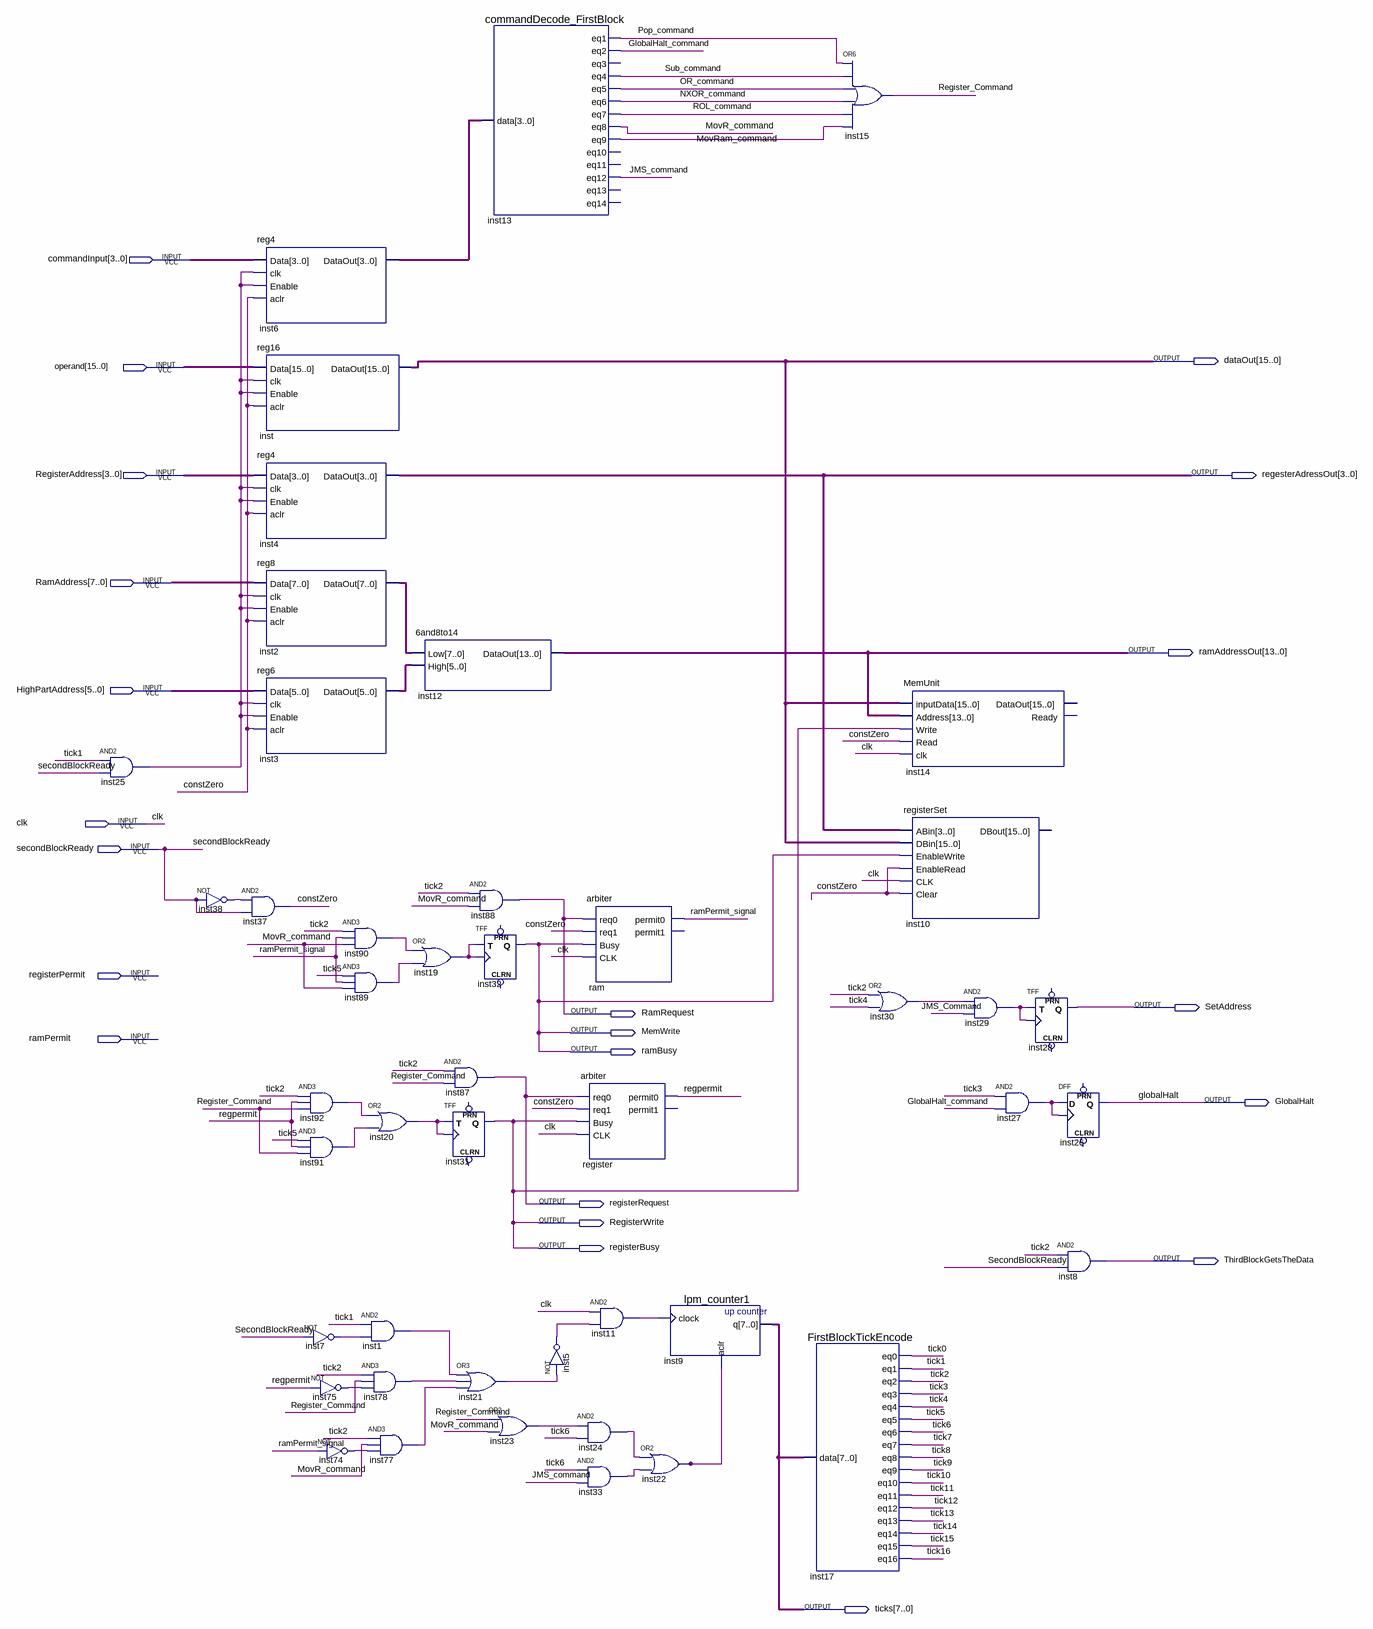
[diagram p0: schematic sheet]
// Quartus schematic WriteBlock.bdf as structural Verilog: 46 symbols, 22 pins
module WriteBlock (
  input  [3:0] commandInput,
  input  [15:0] operand,
  input  [3:0] RegisterAddress,
  input  [7:0] RamAddress,
  input  [5:0] HighPartAddress,
  input  clk,
  input  secondBlockReady,
  input  registerPermit,
  input  ramPermit,
  output [15:0] dataOut,
  output [3:0] regesterAdressOut,
  output [13:0] ramAddressOut,
  output SetAddress,
  output RamRequest,
  output MemWrite,
  output ramBusy,
  output GlobalHalt,
  output registerRequest,
  output RegisterWrite,
  output registerBusy,
  output ThirdBlockGetsTheData,
  output [7:0] ticks
);

  wire constZero, GlobalHalt_command, inst1_out, inst5_out, inst7_out, inst11_out, inst19_out, inst20_out,
       inst21_out, inst22_out, inst23_out, inst24_out, inst25_out, inst27_out, inst29_out, inst30_out,
       inst33_out, inst38_out, inst74_out, inst75_out, inst77_out, inst78_out, inst89_out, inst90_out,
       inst91_out, inst92_out, JMS_command, MovR_command, MovRam_command, NXOR_command, OR_command,
       Pop_command, ramPermit_signal, Register_Command, regpermit, ROL_command, Sub_command, tick0, tick1,
       tick2, tick3, tick4, tick5, tick6, tick7, tick8, tick9, tick10, tick11, tick12, tick13, tick14,
       tick15, tick16;
  wire [3:0] inst6_dataout;
  wire [5:0] inst3_dataout;
  wire [7:0] inst2_dataout;

  and inst25 (inst25_out, tick1, secondBlockReady);
  not inst38 (inst38_out, secondBlockReady);
  reg4 inst6 (.Data(commandInput), .clk(inst25_out), .Enable(inst25_out), .aclr(constZero), .DataOut(inst6_dataout));
  reg16 inst (.Data(operand), .clk(inst25_out), .Enable(inst25_out), .aclr(constZero), .DataOut(dataOut));
  reg4 inst4 (
    .Data(RegisterAddress), .clk(inst25_out), .Enable(inst25_out), .aclr(constZero),
    .DataOut(regesterAdressOut));
  reg8 inst2 (.Data(RamAddress), .clk(inst25_out), .Enable(inst25_out), .aclr(constZero), .DataOut(inst2_dataout));
  reg6 inst3 (.Data(HighPartAddress), .clk(inst25_out), .Enable(inst25_out), .aclr(constZero), .DataOut(inst3_dataout));
  and inst37 (constZero, inst38_out, secondBlockReady);
  and inst92 (inst92_out, tick2, regpermit, Register_Command);
  and inst91 (inst91_out, tick5, regpermit, Register_Command);
  not inst7 (inst7_out, secondBlockReady);
  and inst90 (inst90_out, tick2, ramPermit_signal, MovR_command);
  and inst89 (inst89_out, tick5, ramPermit_signal, MovR_command);
  and inst1 (inst1_out, tick1, inst7_out);
  not inst75 (inst75_out, regpermit);
  not inst74 (inst74_out, ramPermit_signal);
  or inst20 (inst20_out, inst92_out, inst91_out);
  and inst78 (inst78_out, tick2, Register_Command, inst75_out);
  and inst77 (inst77_out, tick2, MovR_command, inst74_out);
  \6and8to14  inst12 (.Low(inst2_dataout), .High(inst3_dataout), .DataOut(ramAddressOut));
  or inst19 (inst19_out, inst90_out, inst89_out);
  and inst87 (registerRequest, tick2, Register_Command);
  TFF inst31 (.T(inst20_out), .CLK(inst20_out), .Q(registerBusy));  // open: PRN, CLRN
  or inst21 (inst21_out, inst1_out, inst78_out, inst77_out);
  commandDecode_FirstBlock inst13 (
    .data(inst6_dataout), .eq1(Pop_command), .eq2(GlobalHalt_command), .eq4(Sub_command), .eq5(OR_command),
    .eq6(NXOR_command), .eq7(ROL_command), .eq8(MovR_command), .eq9(MovRam_command), .eq12(JMS_command));  // open: eq3, eq10, eq11, eq13, eq14
  and inst88 (RamRequest, tick2, MovR_command);
  TFF inst32 (.T(inst19_out), .CLK(inst19_out), .Q(MemWrite));  // open: PRN, CLRN
  or inst23 (inst23_out, Register_Command, MovR_command);
  not inst5 (inst5_out, inst21_out);
  arbiter ram (
    .req0(RamRequest), .req1(constZero), .Busy(MemWrite), .CLK(clk), .permit0(ramPermit_signal));  // open: permit1
  arbiter register (
    .req0(registerRequest), .req1(constZero), .Busy(registerBusy), .CLK(clk), .permit0(regpermit));  // open: permit1
  and inst11 (inst11_out, clk, inst5_out);
  and inst24 (inst24_out, inst23_out, tick6);
  and inst33 (inst33_out, tick6, JMS_command);
  lpm_counter1 inst9 (.clock(inst11_out), .aclr(inst22_out), .q(ticks));
  or inst22 (inst22_out, inst24_out, inst33_out);
  FirstBlockTickEncode inst17 (
    .data(ticks), .eq0(tick0), .eq1(tick1), .eq2(tick2), .eq3(tick3), .eq4(tick4), .eq5(tick5), .eq6(tick6),
    .eq7(tick7), .eq8(tick8), .eq9(tick9), .eq10(tick10), .eq11(tick11), .eq12(tick12), .eq13(tick13),
    .eq14(tick14), .eq15(tick15), .eq16(tick16));
  or inst15 (Register_Command, Pop_command, Sub_command, OR_command, NXOR_command, ROL_command, MovRam_command);
  MemUnit inst14 (
    .inputData(dataOut), .Address(ramAddressOut), .Write(registerBusy), .Read(constZero), .clk(clk));  // open: DataOut, Ready
  registerSet inst10 (
    .ABin(regesterAdressOut), .DBin(dataOut), .EnableWrite(MemWrite), .EnableRead(constZero), .CLK(clk),
    .Clear(constZero));  // open: DBout
  or inst30 (inst30_out, tick2, tick4);
  and inst29 (inst29_out, inst30_out, JMS_command);
  and inst27 (inst27_out, tick3, GlobalHalt_command);
  TFF inst28 (.T(inst29_out), .CLK(inst29_out), .Q(SetAddress));  // open: PRN, CLRN
  DFF inst26 (.CLK(inst27_out), .D(inst27_out), .Q(GlobalHalt));  // open: CLRN, PRN
  and inst8 (ThirdBlockGetsTheData, tick2, secondBlockReady);

  assign ramBusy = MemWrite;
  assign RegisterWrite = registerBusy;
endmodule
